# Altium project MiniPC.PrjPcb (part 10 of 10)
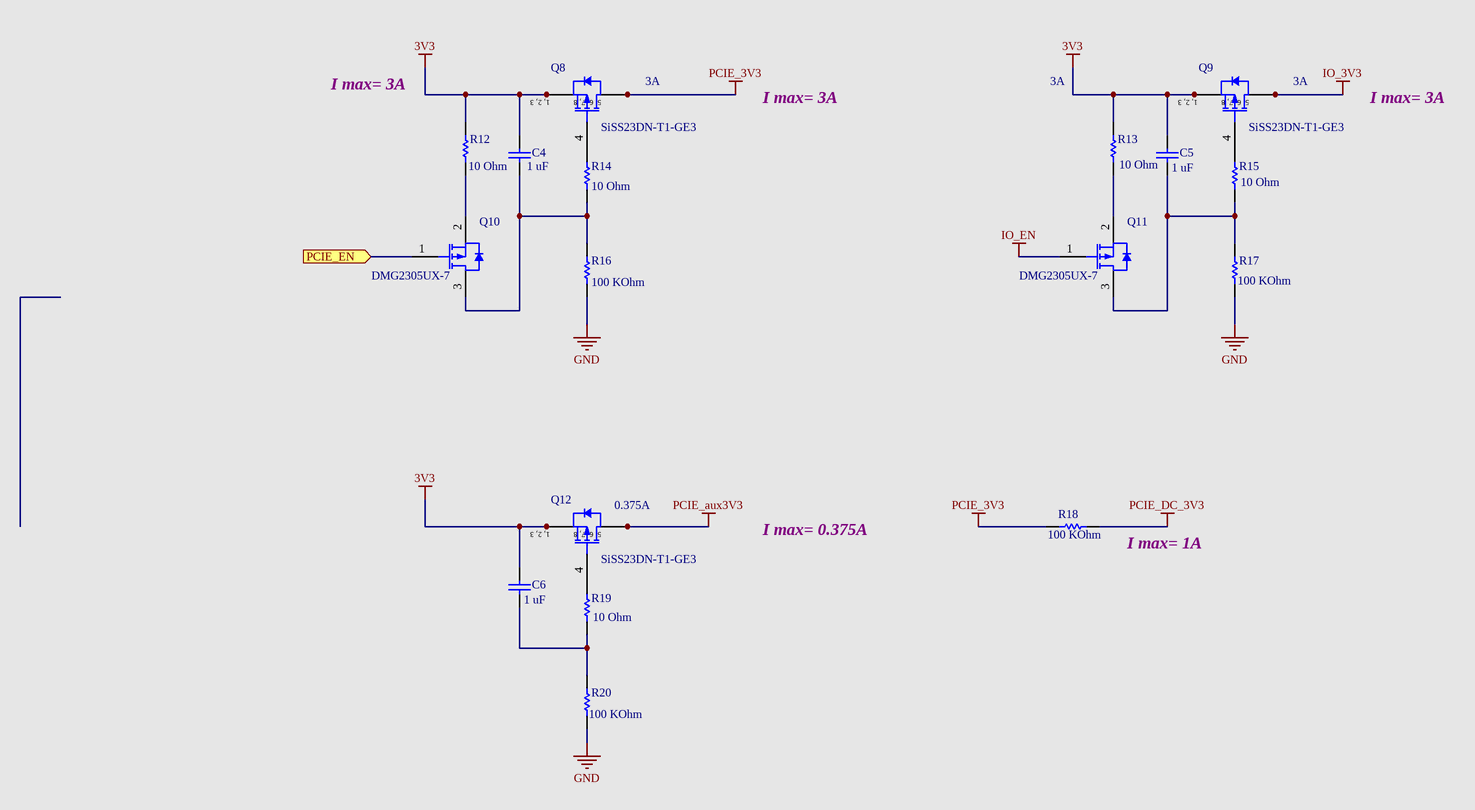
[diagram p128: 3.3V_and_1.8V_Load.SchDoc]

## Nets that join several sheets
3V3: JTAG_Connector (J12.4 R329.2 R330.1 R331.1), miniPCIE_Connector (C481.2 C482.1 J13.2 J13.52), 12V_3V3_1V8_Swiches (8 pins), 12V_to_3V3 (34 pins), 3.3V_and_1.8V_Load (14 pins)
A10_12V: 12V_3V3_1V8_Swiches (5 pins), 12V_to_0V9 (21 pins)
A10_main_1V8: 12V_3V3_1V8_Swiches (5 pins), 2.5V_and_1.8V_Switches (8 pins)
GND: DDR4 (60 pins), DDR4_SODIMM1 (106 pins), DDR4_SODIMM2 (106 pins), Ethernet-HPS (39 pins), SFP_PortA (31 pins), SFP_PortB (31 pins), JTAG_Connector (J12.10 R328.1), Display_Port (20 pins), Ethernet1 (39 pins), Ethernet2 (39 pins), miniPCIE_Connector (18 pins), USB3.0 (22 pins), PCIE_Connector (50 pins), PLL1 (33 pins), PLL (37 pins), 12V_POWER (13 pins), 12V_3V3_1V8_Swiches (13 pins), 12V_to_0V9 (61 pins), 12V_to_3V3 (59 pins), 12V_to_5V (11 pins), 2.5V_and_1.8V_Switches (7 pins), 3.3V_and_1.8V_Load (R16.1 R17.1 R20.1)
IO_1V8: Ethernet-HPS (11 pins), USB3.0 (11 pins), PLL1 (L17.2 L18.2 R333.1 R334.1), PLL (5 pins), 2.5V_and_1.8V_Switches (Q3.1 Q3.2 Q3.3)
IO_2V5: DDR4 (6 pins), DDR4_SODIMM1 (J8.255 J8.257 J8.259 R227.1), DDR4_SODIMM2 (J20.255 J20.257 J20.259 R232.1), Ethernet-HPS (7 pins), Ethernet1 (40 pins), Ethernet2 (40 pins), USB3.0 (X1.4), PLL (9 pins), 2.5V_and_1.8V_Switches (Q1.5 Q1.6 Q1.7 Q1.8)
IO_3V3: Ethernet-HPS (5 pins), SFP_PortA (C551.2 C552.2 L23.1 L24.1), SFP_PortB (C555.2 C557.2 L25.1 L26.1), Display_Port (C297.1 R242.2 U16.5), USB3.0 (6 pins), PLL (C541.2 C542.2 U29.1 U29.10), 3.3V_and_1.8V_Load (Q9.5 Q9.6 Q9.7 Q9.8)
IO_5V: Ethernet-HPS (C384.2 U25.5), Ethernet1 (C327.2 U19.1), Ethernet2 (C353.2 U22.1), 12V_to_5V (11 pins)
IO_EN: 2.5V_and_1.8V_Switches (Q2.1 R7.2), 3.3V_and_1.8V_Load (Q11.1)
MAIN_12V: 12V_POWER (18 pins), 12V_3V3_1V8_Swiches (8 pins), 12V_to_3V3 (21 pins), 12V_to_5V (F1.2), 2.5V_and_1.8V_Switches (R4.2 R5.2 R8.2 R10.2)
PCIE_12V: PCIE_Connector (11 pins), 12V_POWER (Q21.5 Q21.6 Q21.7 Q21.8)
PCIE_aux3V3: PCIE_Connector (C483.2 J14.B10), 3.3V_and_1.8V_Load (Q12.5 Q12.6 Q12.7 Q12.8)
PCIE_DC_3V3: PCIE_Connector (7 pins), 3.3V_and_1.8V_Load (R18.1)
PCIE_EN: 12V_POWER (R139.1), 3.3V_and_1.8V_Load (Q10.1)
PMbus_ALTERTn: 12V_to_0V9 (U10#1.E5), 12V_to_3V3 (R161.1 U23.E5)
PMbus_SCL_3V3: 12V_to_0V9 (U10#1.E6), 12V_to_3V3 (R159.1 U23.E6)
PMbus_SDA_3V3: 12V_to_0V9 (U10#1.D6), 12V_to_3V3 (R160.1 U23.D6)
VDD_DDR: DDR4 (72 pins), DDR4_SODIMM1 (25 pins), DDR4_SODIMM2 (25 pins)
CLOCK_I2C_SCL: PLL1 (U27.12 U28.12), PLL (U30.12)
CLOCK_I2C_SDA: PLL1 (U27.19 U28.19), PLL (U30.19)
DDR4_SODIMM_A0: DDR4_SODIMM1 (J8.144), DDR4_SODIMM2 (J20.144)
DDR4_SODIMM_A1: DDR4_SODIMM1 (J8.133), DDR4_SODIMM2 (J20.133)
DDR4_SODIMM_A2: DDR4_SODIMM1 (J8.132), DDR4_SODIMM2 (J20.132)
DDR4_SODIMM_A3: DDR4_SODIMM1 (J8.131), DDR4_SODIMM2 (J20.131)
DDR4_SODIMM_A4: DDR4_SODIMM1 (J8.128), DDR4_SODIMM2 (J20.128)
DDR4_SODIMM_A5: DDR4_SODIMM1 (J8.126), DDR4_SODIMM2 (J20.126)
DDR4_SODIMM_A6: DDR4_SODIMM1 (J8.127), DDR4_SODIMM2 (J20.127)
DDR4_SODIMM_A7: DDR4_SODIMM1 (J8.122), DDR4_SODIMM2 (J20.122)
DDR4_SODIMM_A8: DDR4_SODIMM1 (J8.125), DDR4_SODIMM2 (J20.125)
DDR4_SODIMM_A9: DDR4_SODIMM1 (J8.121), DDR4_SODIMM2 (J20.121)
DDR4_SODIMM_A10: DDR4_SODIMM1 (J8.146), DDR4_SODIMM2 (J20.146)
DDR4_SODIMM_A11: DDR4_SODIMM1 (J8.120), DDR4_SODIMM2 (J20.120)
DDR4_SODIMM_A12: DDR4_SODIMM1 (J8.119), DDR4_SODIMM2 (J20.119)
DDR4_SODIMM_A13: DDR4_SODIMM1 (J8.158), DDR4_SODIMM2 (J20.158)
DDR4_SODIMM_A14: DDR4_SODIMM1 (J8.151), DDR4_SODIMM2 (J20.151)
DDR4_SODIMM_A15: DDR4_SODIMM1 (J8.156), DDR4_SODIMM2 (J20.156)
DDR4_SODIMM_A16: DDR4_SODIMM1 (J8.152), DDR4_SODIMM2 (J20.152)
DDR4_SODIMM_ACT: DDR4_SODIMM1 (J8.114), DDR4_SODIMM2 (J20.114)
DDR4_SODIMM_ALERT: DDR4_SODIMM1 (J8.116), DDR4_SODIMM2 (J20.116)
DDR4_SODIMM_BA0: DDR4_SODIMM1 (J8.150), DDR4_SODIMM2 (J20.150)
DDR4_SODIMM_BA1: DDR4_SODIMM1 (J8.145), DDR4_SODIMM2 (J20.145)
DDR4_SODIMM_BG0: DDR4_SODIMM1 (J8.115), DDR4_SODIMM2 (J20.115)
DDR4_SODIMM_BG1: DDR4_SODIMM1 (J8.113), DDR4_SODIMM2 (J20.113)
DDR4_SODIMM_DM0: DDR4_SODIMM1 (J8.12), DDR4_SODIMM2 (J20.12)
DDR4_SODIMM_DM1: DDR4_SODIMM1 (J8.33), DDR4_SODIMM2 (J20.33)
DDR4_SODIMM_DM2: DDR4_SODIMM1 (J8.54), DDR4_SODIMM2 (J20.54)
DDR4_SODIMM_DM3: DDR4_SODIMM1 (J8.75), DDR4_SODIMM2 (J20.75)
DDR4_SODIMM_DM4: DDR4_SODIMM1 (J8.178), DDR4_SODIMM2 (J20.178)
DDR4_SODIMM_DM5: DDR4_SODIMM1 (J8.199), DDR4_SODIMM2 (J20.199)
DDR4_SODIMM_DM6: DDR4_SODIMM1 (J8.220), DDR4_SODIMM2 (J20.220)
DDR4_SODIMM_DM7: DDR4_SODIMM1 (J8.241), DDR4_SODIMM2 (J20.241)
DDR4_SODIMM_DQ0: DDR4_SODIMM1 (J8.8), DDR4_SODIMM2 (J20.8)
DDR4_SODIMM_DQ1: DDR4_SODIMM1 (J8.7), DDR4_SODIMM2 (J20.7)
DDR4_SODIMM_DQ2: DDR4_SODIMM1 (J8.20), DDR4_SODIMM2 (J20.20)
DDR4_SODIMM_DQ3: DDR4_SODIMM1 (J8.21), DDR4_SODIMM2 (J20.21)
DDR4_SODIMM_DQ4: DDR4_SODIMM1 (J8.4), DDR4_SODIMM2 (J20.4)
DDR4_SODIMM_DQ5: DDR4_SODIMM1 (J8.3), DDR4_SODIMM2 (J20.3)
DDR4_SODIMM_DQ6: DDR4_SODIMM1 (J8.16), DDR4_SODIMM2 (J20.16)
DDR4_SODIMM_DQ7: DDR4_SODIMM1 (J8.17), DDR4_SODIMM2 (J20.17)
DDR4_SODIMM_DQ8: DDR4_SODIMM1 (J8.28), DDR4_SODIMM2 (J20.28)
DDR4_SODIMM_DQ9: DDR4_SODIMM1 (J8.29), DDR4_SODIMM2 (J20.29)
DDR4_SODIMM_DQ10: DDR4_SODIMM1 (J8.41), DDR4_SODIMM2 (J20.41)
DDR4_SODIMM_DQ11: DDR4_SODIMM1 (J8.42), DDR4_SODIMM2 (J20.42)
DDR4_SODIMM_DQ12: DDR4_SODIMM1 (J8.24), DDR4_SODIMM2 (J20.24)
DDR4_SODIMM_DQ13: DDR4_SODIMM1 (J8.25), DDR4_SODIMM2 (J20.25)
DDR4_SODIMM_DQ14: DDR4_SODIMM1 (J8.38), DDR4_SODIMM2 (J20.38)
DDR4_SODIMM_DQ15: DDR4_SODIMM1 (J8.37), DDR4_SODIMM2 (J20.37)
DDR4_SODIMM_DQ16: DDR4_SODIMM1 (J8.50), DDR4_SODIMM2 (J20.50)
DDR4_SODIMM_DQ17: DDR4_SODIMM1 (J8.49), DDR4_SODIMM2 (J20.49)
DDR4_SODIMM_DQ18: DDR4_SODIMM1 (J8.62), DDR4_SODIMM2 (J20.62)
DDR4_SODIMM_DQ19: DDR4_SODIMM1 (J8.63), DDR4_SODIMM2 (J20.63)
DDR4_SODIMM_DQ20: DDR4_SODIMM1 (J8.46), DDR4_SODIMM2 (J20.46)
DDR4_SODIMM_DQ21: DDR4_SODIMM1 (J8.45), DDR4_SODIMM2 (J20.45)
DDR4_SODIMM_DQ22: DDR4_SODIMM1 (J8.58), DDR4_SODIMM2 (J20.58)
DDR4_SODIMM_DQ23: DDR4_SODIMM1 (J8.59), DDR4_SODIMM2 (J20.59)
DDR4_SODIMM_DQ24: DDR4_SODIMM1 (J8.70), DDR4_SODIMM2 (J20.70)
DDR4_SODIMM_DQ25: DDR4_SODIMM1 (J8.71), DDR4_SODIMM2 (J20.71)
DDR4_SODIMM_DQ26: DDR4_SODIMM1 (J8.83), DDR4_SODIMM2 (J20.83)
DDR4_SODIMM_DQ27: DDR4_SODIMM1 (J8.84), DDR4_SODIMM2 (J20.84)
DDR4_SODIMM_DQ28: DDR4_SODIMM1 (J8.66), DDR4_SODIMM2 (J20.66)
DDR4_SODIMM_DQ29: DDR4_SODIMM1 (J8.67), DDR4_SODIMM2 (J20.67)
DDR4_SODIMM_DQ30: DDR4_SODIMM1 (J8.79), DDR4_SODIMM2 (J20.79)
DDR4_SODIMM_DQ31: DDR4_SODIMM1 (J8.80), DDR4_SODIMM2 (J20.80)
DDR4_SODIMM_DQ32: DDR4_SODIMM1 (J8.174), DDR4_SODIMM2 (J20.174)
DDR4_SODIMM_DQ33: DDR4_SODIMM1 (J8.173), DDR4_SODIMM2 (J20.173)
DDR4_SODIMM_DQ34: DDR4_SODIMM1 (J8.187), DDR4_SODIMM2 (J20.187)
DDR4_SODIMM_DQ35: DDR4_SODIMM1 (J8.186), DDR4_SODIMM2 (J20.186)
DDR4_SODIMM_DQ36: DDR4_SODIMM1 (J8.170), DDR4_SODIMM2 (J20.170)
DDR4_SODIMM_DQ37: DDR4_SODIMM1 (J8.169), DDR4_SODIMM2 (J20.169)
DDR4_SODIMM_DQ38: DDR4_SODIMM1 (J8.183), DDR4_SODIMM2 (J20.183)
DDR4_SODIMM_DQ39: DDR4_SODIMM1 (J8.182), DDR4_SODIMM2 (J20.182)
DDR4_SODIMM_DQ40: DDR4_SODIMM1 (J8.195), DDR4_SODIMM2 (J20.195)
DDR4_SODIMM_DQ41: DDR4_SODIMM1 (J8.194), DDR4_SODIMM2 (J20.194)
DDR4_SODIMM_DQ42: DDR4_SODIMM1 (J8.207), DDR4_SODIMM2 (J20.207)
DDR4_SODIMM_DQ43: DDR4_SODIMM1 (J8.208), DDR4_SODIMM2 (J20.208)
DDR4_SODIMM_DQ44: DDR4_SODIMM1 (J8.191), DDR4_SODIMM2 (J20.191)
DDR4_SODIMM_DQ45: DDR4_SODIMM1 (J8.190), DDR4_SODIMM2 (J20.190)
DDR4_SODIMM_DQ46: DDR4_SODIMM1 (J8.203), DDR4_SODIMM2 (J20.203)
DDR4_SODIMM_DQ47: DDR4_SODIMM1 (J8.204), DDR4_SODIMM2 (J20.204)
DDR4_SODIMM_DQ48: DDR4_SODIMM1 (J8.216), DDR4_SODIMM2 (J20.216)
DDR4_SODIMM_DQ49: DDR4_SODIMM1 (J8.215), DDR4_SODIMM2 (J20.215)
DDR4_SODIMM_DQ50: DDR4_SODIMM1 (J8.228), DDR4_SODIMM2 (J20.228)
DDR4_SODIMM_DQ51: DDR4_SODIMM1 (J8.229), DDR4_SODIMM2 (J20.229)
DDR4_SODIMM_DQ52: DDR4_SODIMM1 (J8.211), DDR4_SODIMM2 (J20.211)
DDR4_SODIMM_DQ53: DDR4_SODIMM1 (J8.212), DDR4_SODIMM2 (J20.212)
DDR4_SODIMM_DQ54: DDR4_SODIMM1 (J8.224), DDR4_SODIMM2 (J20.224)
DDR4_SODIMM_DQ55: DDR4_SODIMM1 (J8.225), DDR4_SODIMM2 (J20.225)
DDR4_SODIMM_DQ56: DDR4_SODIMM1 (J8.237), DDR4_SODIMM2 (J20.237)
DDR4_SODIMM_DQ57: DDR4_SODIMM1 (J8.236), DDR4_SODIMM2 (J20.236)
DDR4_SODIMM_DQ58: DDR4_SODIMM1 (J8.249), DDR4_SODIMM2 (J20.249)
DDR4_SODIMM_DQ59: DDR4_SODIMM1 (J8.250), DDR4_SODIMM2 (J20.250)
DDR4_SODIMM_DQ60: DDR4_SODIMM1 (J8.232), DDR4_SODIMM2 (J20.232)
DDR4_SODIMM_DQ61: DDR4_SODIMM1 (J8.233), DDR4_SODIMM2 (J20.233)
DDR4_SODIMM_DQ62: DDR4_SODIMM1 (J8.245), DDR4_SODIMM2 (J20.245)
DDR4_SODIMM_DQ63: DDR4_SODIMM1 (J8.246), DDR4_SODIMM2 (J20.246)
DDR4_SODIMM_DQS0_N: DDR4_SODIMM1 (J8.11), DDR4_SODIMM2 (J20.11)
DDR4_SODIMM_DQS0_P: DDR4_SODIMM1 (J8.13), DDR4_SODIMM2 (J20.13)
DDR4_SODIMM_DQS1_N: DDR4_SODIMM1 (J8.32), DDR4_SODIMM2 (J20.32)
DDR4_SODIMM_DQS1_P: DDR4_SODIMM1 (J8.34), DDR4_SODIMM2 (J20.34)
DDR4_SODIMM_DQS2_N: DDR4_SODIMM1 (J8.53), DDR4_SODIMM2 (J20.53)
DDR4_SODIMM_DQS2_P: DDR4_SODIMM1 (J8.55), DDR4_SODIMM2 (J20.55)
DDR4_SODIMM_DQS3_N: DDR4_SODIMM1 (J8.74), DDR4_SODIMM2 (J20.74)
DDR4_SODIMM_DQS3_P: DDR4_SODIMM1 (J8.76), DDR4_SODIMM2 (J20.76)
DDR4_SODIMM_DQS4_N: DDR4_SODIMM1 (J8.177), DDR4_SODIMM2 (J20.177)
DDR4_SODIMM_DQS4_P: DDR4_SODIMM1 (J8.179), DDR4_SODIMM2 (J20.179)
DDR4_SODIMM_DQS5_N: DDR4_SODIMM1 (J8.198), DDR4_SODIMM2 (J20.198)
DDR4_SODIMM_DQS5_P: DDR4_SODIMM1 (J8.200), DDR4_SODIMM2 (J20.200)
DDR4_SODIMM_DQS6_N: DDR4_SODIMM1 (J8.219), DDR4_SODIMM2 (J20.219)
DDR4_SODIMM_DQS6_P: DDR4_SODIMM1 (J8.221), DDR4_SODIMM2 (J20.221)
DDR4_SODIMM_DQS7_N: DDR4_SODIMM1 (J8.240), DDR4_SODIMM2 (J20.240)
DDR4_SODIMM_DQS7_P: DDR4_SODIMM1 (J8.242), DDR4_SODIMM2 (J20.242)
DDR4_SODIMM_PARITY: DDR4_SODIMM1 (J8.143), DDR4_SODIMM2 (J20.143)
DDR4_SODIMM_RESET_CONN: DDR4_SODIMM1 (J8.108), DDR4_SODIMM2 (J20.108)
DDR4_SODIMM_SA0: DDR4_SODIMM1 (J8.256), DDR4_SODIMM2 (J20.256)
DDR4_SODIMM_SA1: DDR4_SODIMM1 (J8.260), DDR4_SODIMM2 (J20.260)
DDR4_SODIMM_SA2: DDR4_SODIMM1 (J8.166), DDR4_SODIMM2 (J20.166)
DDR4_SODIMM_SCL: DDR4_SODIMM1 (J8.253), DDR4_SODIMM2 (J20.253)
DDR4_SODIMM_SDA: DDR4_SODIMM1 (J8.254), DDR4_SODIMM2 (J20.254)
ENETA_INTn: Ethernet1 (R261.1 U17.A12), Ethernet2 (R285.1 U20.A12)
ENETA_MDC: Ethernet1 (R259.1 U17.A14), Ethernet2 (R283.1 U20.A14)
ENETA_MDIO: Ethernet1 (R260.1 U17.A13), Ethernet2 (R284.1 U20.A13)
ENETA_RESETn: Ethernet1 (R263.1 U17.B13), Ethernet2 (R287.1 U20.B13)
EXTA_SDA: SFP_PortA (J7.4), PCIE_Connector (J14.B6)
PCIE_REFCLK_SYN_N: PCIE_Connector (J14.A14), PLL (R338.2)
PCIE_REFCLK_SYN_P: PCIE_Connector (J14.A13), PLL (R337.2)